# Altium schematic sheet gyro.SchDoc
size A4; SheetNumber: 6; SheetTotal: 6
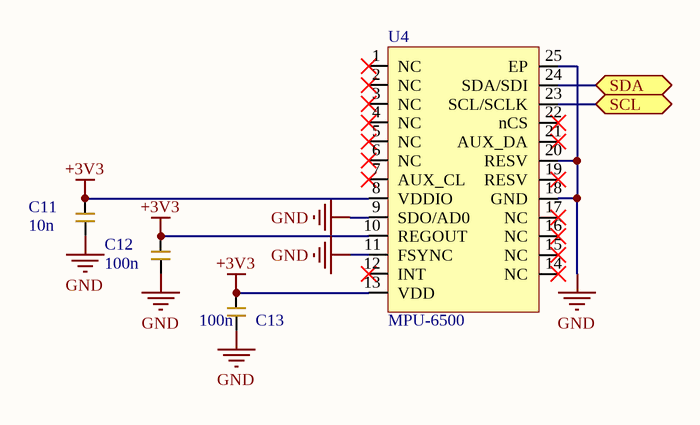
[diagram p0: gyro.SchDoc]

## Parts
C11  10n  [CAP_0603]
C12  100n  [CAP_0603]
C13  100n  [CAP_0603]
U4  MPU-6500  [MPU-6500]

## Ports
SCL (bidir), SDA (bidir)

## Nets
+3V3: C11.2 C12.2 C13.2 U4.8(VDDIO) U4.10(REGOUT) U4.13(VDD)
GND: C11.1 C12.1 C13.1 U4.9(SDO/AD0) U4.11(FSYNC) U4.18(GND) U4.20(RESV) U4.25(EP)
SCL: U4.23(SCL/SCLK) ; port SCL
SDA: U4.24(SDA/SDI) ; port SDA

Not connected (* = marked no-connect by the designer): U4 1(NC)* 2(NC)* 3(NC)* 4(NC)* 5(NC)* 6(NC)* 7(AUX_CL)* 12(INT)* 14(NC)* 15(NC)* 16(NC)* 17(NC)* 19(RESV)* 21(AUX_DA)* 22(nCS)*

## Library data of the parts
C11-C13 = CAP_0603: Multilayer Ceramic Capacitors MLCC - SMD/SMT ROHS; Mfr.: *; Voltage Rating: *; Package: 0603; LCSC: *; Mfr. Part: *
U4 = MPU-6500: Accelerometer gyroscope QFN-24-EP(3x3) Accelerometers ROHS; Mfr.: TDK InvenSense; LCSC: C50278; Mfr. Part: MPU-6500